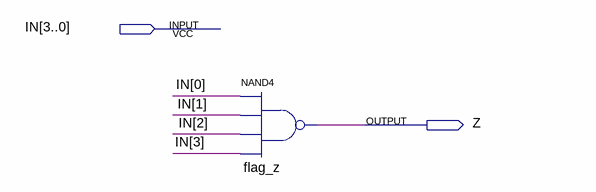
[diagram p0: schematic sheet]
// Quartus schematic flag_z.bdf as structural Verilog: 1 symbols, 2 pins
module flag_z (
  input  [3:0] IN,
  output Z
);

  nand flag_z (Z, IN[0], IN[1], IN[2], IN[3]);
endmodule
